# EAGLE schematic 24x16_RGB (EAGLE 6.4)

## Sheet 1 of 7
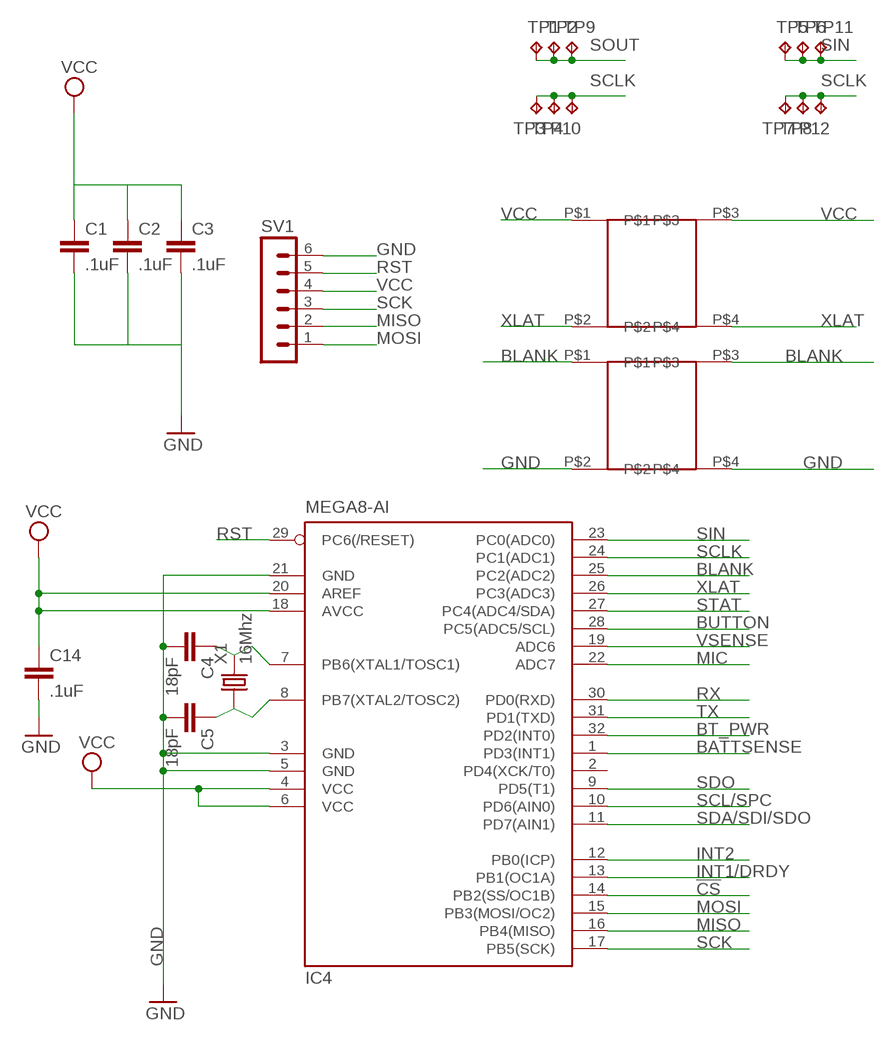
[diagram p0: schematic, sheet 1]

### Parts
C1  .1uF  CAP0805  [0805]
C2  .1uF  CAP0805  [0805]
C3  .1uF  CAP0805  [0805]
C4  18pF  CAP0805  [0805]
C5  18pF  CAP0805  [0805]
C14  .1uF  CAP0805  [0805]
IC4  MEGA8-AI  [TQFP32-08]
SLOT1  SLOT  [SLOT]
SLOT2  SLOT  [SLOT]
SV1  MA06-1  [MA06-1]
TP1  TPTP20SQ  [TP20SQ]
TP2  TPTP20SQ  [TP20SQ]
TP3  TPTP20SQ  [TP20SQ]
TP4  TPTP20SQ  [TP20SQ]
TP5  TPTP20SQ  [TP20SQ]
TP6  TPTP20SQ  [TP20SQ]
TP7  TPTP20SQ  [TP20SQ]
TP8  TPTP20SQ  [TP20SQ]
TP9  TPTP20SQ  [TP20SQ]
TP10  TPTP20SQ  [TP20SQ]
TP11  TPTP20SQ  [TP20SQ]
TP12  TPTP20SQ  [TP20SQ]
X1  16Mhz  CRYSTAL-5032  [5032]

### Nets
!CS: IC4.14(PB2(SS/OC1B)) ; also sheet 6
BATTSENSE: IC4.1(PD3(INT1)) ; also sheet 4
BLANK: IC4.25(PC2(ADC2)) SLOT2.P$1 SLOT2.P$3 ; also sheet 2
BT_PWR: IC4.32(PD2(INT0)) ; also sheet 5
BUTTON: IC4.28(PC5(ADC5/SCL)) ; also sheet 6
GND: C1.2 C2.2 C3.2 C4.2 C5.2 C14.2 IC4.3(GND) IC4.5(GND) IC4.21(GND) SLOT2.P$2 SLOT2.P$4 SV1.6 ; also sheet 2,4,5,6,7
INT1/DRDY: IC4.13(PB1(OC1A)) ; also sheet 6
INT2: IC4.12(PB0(ICP)) ; also sheet 6
MIC: IC4.22(ADC7) ; also sheet 7
MISO: IC4.16(PB4(MISO)) SV1.2
MOSI: IC4.15(PB3(MOSI/OC2)) SV1.1
N$7: C4.1 IC4.7(PB6(XTAL1/TOSC1)) X1.2
N$8: C5.1 IC4.8(PB7(XTAL2/TOSC2)) X1.1
RST: IC4.29(PC6(/RESET)) SV1.5 ; also sheet 6
RX: IC4.30(PD0(RXD)) ; also sheet 5
SCK: IC4.17(PB5(SCK)) SV1.3
SCL/SPC: IC4.10(PD6(AIN0)) ; also sheet 6
SCLK: IC4.24(PC1(ADC1)) TP3.TP TP4.TP TP7.TP TP8.TP TP10.TP TP12.TP ; also sheet 2
SDA/SDI/SDO: IC4.11(PD7(AIN1)) ; also sheet 6
SDO: IC4.9(PD5(T1)) ; also sheet 6
SIN: IC4.23(PC0(ADC0)) TP5.TP TP6.TP TP11.TP ; also sheet 2
SOUT: TP1.TP TP2.TP TP9.TP ; also sheet 2
STAT: IC4.27(PC4(ADC4/SDA)) ; also sheet 4
TX: IC4.31(PD1(TXD)) ; also sheet 5
VCC: C1.1 C2.1 C3.1 C14.1 IC4.4(VCC) IC4.6(VCC) IC4.18(AVCC) IC4.20(AREF) SLOT1.P$1 SLOT1.P$3 SV1.4 ; also sheet 2,3,4,5,6,7
VSENSE: IC4.19(ADC6)
XLAT: IC4.26(PC3(ADC3)) SLOT1.P$2 SLOT1.P$4 ; also sheet 2
Unconnected: IC4.2(PD4(XCK/T0))

## Sheet 2 of 7
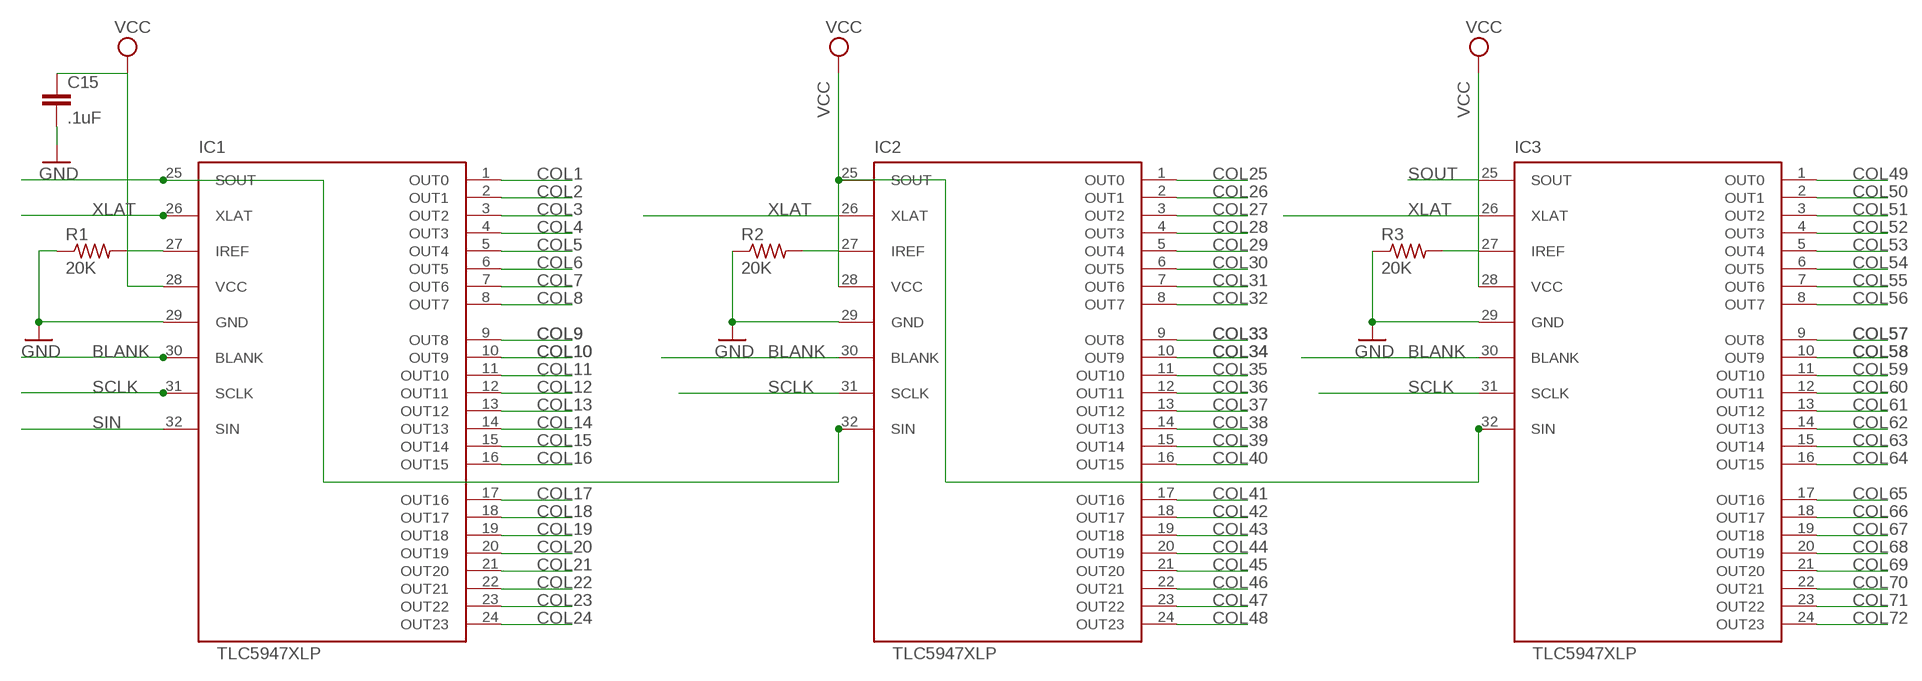
[diagram p1: schematic, sheet 2]

### Parts
C15  .1uF  CAP0805  [0805]
IC1  TLC5947XLP  [QFN32_XLP]
IC2  TLC5947XLP  [QFN32_XLP]
IC3  TLC5947XLP  [QFN32_XLP]
R1  20K  R-US_R0805  [R0805]
R2  20K  R-US_R0805  [R0805]
R3  20K  R-US_R0805  [R0805]

### Nets
BLANK: IC1.30(BLANK) IC2.30(BLANK) IC3.30(BLANK) ; also sheet 1
COL1: IC1.1(OUT0) ; also sheet 3
COL2: IC1.2(OUT1) ; also sheet 3
COL3: IC1.3(OUT2) ; also sheet 3
COL4: IC1.4(OUT3) ; also sheet 3
COL5: IC1.5(OUT4) ; also sheet 3
COL6: IC1.6(OUT5) ; also sheet 3
COL7: IC1.7(OUT6) ; also sheet 3
COL8: IC1.8(OUT7) ; also sheet 3
COL9: IC1.9(OUT8) ; also sheet 3
COL10: IC1.10(OUT9) ; also sheet 3
COL11: IC1.11(OUT10) ; also sheet 3
COL12: IC1.12(OUT11) ; also sheet 3
COL13: IC1.13(OUT12) ; also sheet 3
COL14: IC1.14(OUT13) ; also sheet 3
COL15: IC1.15(OUT14) ; also sheet 3
COL16: IC1.16(OUT15) ; also sheet 3
COL17: IC1.17(OUT16) ; also sheet 3
COL18: IC1.18(OUT17) ; also sheet 3
COL19: IC1.19(OUT18) ; also sheet 3
COL20: IC1.20(OUT19) ; also sheet 3
COL21: IC1.21(OUT20) ; also sheet 3
COL22: IC1.22(OUT21) ; also sheet 3
COL23: IC1.23(OUT22) ; also sheet 3
COL24: IC1.24(OUT23) ; also sheet 3
COL25: IC2.1(OUT0) ; also sheet 3
COL26: IC2.2(OUT1) ; also sheet 3
COL27: IC2.3(OUT2) ; also sheet 3
COL28: IC2.4(OUT3) ; also sheet 3
COL29: IC2.5(OUT4) ; also sheet 3
COL30: IC2.6(OUT5) ; also sheet 3
COL31: IC2.7(OUT6) ; also sheet 3
COL32: IC2.8(OUT7) ; also sheet 3
COL33: IC2.9(OUT8) ; also sheet 3
COL34: IC2.10(OUT9) ; also sheet 3
COL35: IC2.11(OUT10) ; also sheet 3
COL36: IC2.12(OUT11) ; also sheet 3
COL37: IC2.13(OUT12) ; also sheet 3
COL38: IC2.14(OUT13) ; also sheet 3
COL39: IC2.15(OUT14) ; also sheet 3
COL40: IC2.16(OUT15) ; also sheet 3
COL41: IC2.17(OUT16) ; also sheet 3
COL42: IC2.18(OUT17) ; also sheet 3
COL43: IC2.19(OUT18) ; also sheet 3
COL44: IC2.20(OUT19) ; also sheet 3
COL45: IC2.21(OUT20) ; also sheet 3
COL46: IC2.22(OUT21) ; also sheet 3
COL47: IC2.23(OUT22) ; also sheet 3
COL48: IC2.24(OUT23) ; also sheet 3
COL49: IC3.1(OUT0) ; also sheet 3
COL50: IC3.2(OUT1) ; also sheet 3
COL51: IC3.3(OUT2) ; also sheet 3
COL52: IC3.4(OUT3) ; also sheet 3
COL53: IC3.5(OUT4) ; also sheet 3
COL54: IC3.6(OUT5) ; also sheet 3
COL55: IC3.7(OUT6) ; also sheet 3
COL56: IC3.8(OUT7) ; also sheet 3
COL57: IC3.9(OUT8) ; also sheet 3
COL58: IC3.10(OUT9) ; also sheet 3
COL59: IC3.11(OUT10) ; also sheet 3
COL60: IC3.12(OUT11) ; also sheet 3
COL61: IC3.13(OUT12) ; also sheet 3
COL62: IC3.14(OUT13) ; also sheet 3
COL63: IC3.15(OUT14) ; also sheet 3
COL64: IC3.16(OUT15) ; also sheet 3
COL65: IC3.17(OUT16) ; also sheet 3
COL66: IC3.18(OUT17) ; also sheet 3
COL67: IC3.19(OUT18) ; also sheet 3
COL68: IC3.20(OUT19) ; also sheet 3
COL69: IC3.21(OUT20) ; also sheet 3
COL70: IC3.22(OUT21) ; also sheet 3
COL71: IC3.23(OUT22) ; also sheet 3
COL72: IC3.24(OUT23) ; also sheet 3
GND: C15.2 IC1.29(GND) IC2.29(GND) IC3.29(GND) R1.1 R2.1 R3.1 ; also sheet 1,4,5,6,7
HOLE: IC1.27(IREF) R1.2
N$2: IC2.27(IREF) R2.2
N$3: IC1.25(SOUT) IC2.32(SIN)
N$9: IC3.27(IREF) R3.2
N$35: IC2.25(SOUT) IC3.32(SIN)
SCLK: IC1.31(SCLK) IC2.31(SCLK) IC3.31(SCLK) ; also sheet 1
SIN: IC1.32(SIN) ; also sheet 1
SOUT: IC3.25(SOUT) ; also sheet 1
VCC: C15.1 IC1.28(VCC) IC2.28(VCC) IC3.28(VCC) ; also sheet 1,3,4,5,6,7
XLAT: IC1.26(XLAT) IC2.26(XLAT) IC3.26(XLAT) ; also sheet 1

## Sheet 3 of 7
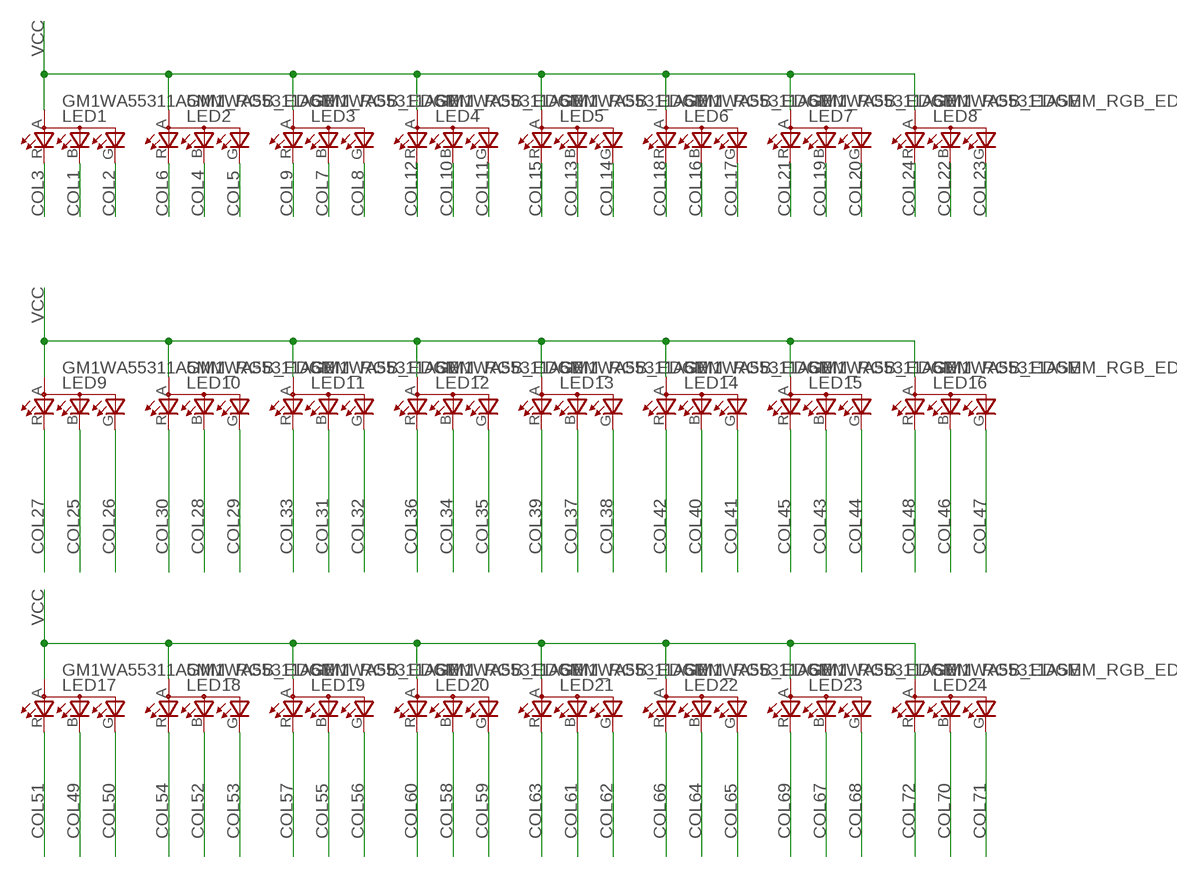
[diagram p2: schematic, sheet 3]

### Parts
LED1  GM1WA55311A5MM_RGB_EDGE  [LED5MM_RGB_EDGE]
LED2  GM1WA55311A5MM_RGB_EDGE  [LED5MM_RGB_EDGE]
LED3  GM1WA55311A5MM_RGB_EDGE  [LED5MM_RGB_EDGE]
LED4  GM1WA55311A5MM_RGB_EDGE  [LED5MM_RGB_EDGE]
LED5  GM1WA55311A5MM_RGB_EDGE  [LED5MM_RGB_EDGE]
LED6  GM1WA55311A5MM_RGB_EDGE  [LED5MM_RGB_EDGE]
LED7  GM1WA55311A5MM_RGB_EDGE  [LED5MM_RGB_EDGE]
LED8  GM1WA55311A5MM_RGB_EDGE  [LED5MM_RGB_EDGE]
LED9  GM1WA55311A5MM_RGB_EDGE  [LED5MM_RGB_EDGE]
LED10  GM1WA55311A5MM_RGB_EDGE  [LED5MM_RGB_EDGE]
LED11  GM1WA55311A5MM_RGB_EDGE  [LED5MM_RGB_EDGE]
LED12  GM1WA55311A5MM_RGB_EDGE  [LED5MM_RGB_EDGE]
LED13  GM1WA55311A5MM_RGB_EDGE  [LED5MM_RGB_EDGE]
LED14  GM1WA55311A5MM_RGB_EDGE  [LED5MM_RGB_EDGE]
LED15  GM1WA55311A5MM_RGB_EDGE  [LED5MM_RGB_EDGE]
LED16  GM1WA55311A5MM_RGB_EDGE  [LED5MM_RGB_EDGE]
LED17  GM1WA55311A5MM_RGB_EDGE  [LED5MM_RGB_EDGE]
LED18  GM1WA55311A5MM_RGB_EDGE  [LED5MM_RGB_EDGE]
LED19  GM1WA55311A5MM_RGB_EDGE  [LED5MM_RGB_EDGE]
LED20  GM1WA55311A5MM_RGB_EDGE  [LED5MM_RGB_EDGE]
LED21  GM1WA55311A5MM_RGB_EDGE  [LED5MM_RGB_EDGE]
LED22  GM1WA55311A5MM_RGB_EDGE  [LED5MM_RGB_EDGE]
LED23  GM1WA55311A5MM_RGB_EDGE  [LED5MM_RGB_EDGE]
LED24  GM1WA55311A5MM_RGB_EDGE  [LED5MM_RGB_EDGE]

### Nets
COL1: LED1.B(CBLUE) ; also sheet 2
COL2: LED1.G(CGREEN) ; also sheet 2
COL3: LED1.R(CRED) ; also sheet 2
COL4: LED2.B(CBLUE) ; also sheet 2
COL5: LED2.G(CGREEN) ; also sheet 2
COL6: LED2.R(CRED) ; also sheet 2
COL7: LED3.B(CBLUE) ; also sheet 2
COL8: LED3.G(CGREEN) ; also sheet 2
COL9: LED3.R(CRED) ; also sheet 2
COL10: LED4.B(CBLUE) ; also sheet 2
COL11: LED4.G(CGREEN) ; also sheet 2
COL12: LED4.R(CRED) ; also sheet 2
COL13: LED5.B(CBLUE) ; also sheet 2
COL14: LED5.G(CGREEN) ; also sheet 2
COL15: LED5.R(CRED) ; also sheet 2
COL16: LED6.B(CBLUE) ; also sheet 2
COL17: LED6.G(CGREEN) ; also sheet 2
COL18: LED6.R(CRED) ; also sheet 2
COL19: LED7.B(CBLUE) ; also sheet 2
COL20: LED7.G(CGREEN) ; also sheet 2
COL21: LED7.R(CRED) ; also sheet 2
COL22: LED8.B(CBLUE) ; also sheet 2
COL23: LED8.G(CGREEN) ; also sheet 2
COL24: LED8.R(CRED) ; also sheet 2
COL25: LED9.B(CBLUE) ; also sheet 2
COL26: LED9.G(CGREEN) ; also sheet 2
COL27: LED9.R(CRED) ; also sheet 2
COL28: LED10.B(CBLUE) ; also sheet 2
COL29: LED10.G(CGREEN) ; also sheet 2
COL30: LED10.R(CRED) ; also sheet 2
COL31: LED11.B(CBLUE) ; also sheet 2
COL32: LED11.G(CGREEN) ; also sheet 2
COL33: LED11.R(CRED) ; also sheet 2
COL34: LED12.B(CBLUE) ; also sheet 2
COL35: LED12.G(CGREEN) ; also sheet 2
COL36: LED12.R(CRED) ; also sheet 2
COL37: LED13.B(CBLUE) ; also sheet 2
COL38: LED13.G(CGREEN) ; also sheet 2
COL39: LED13.R(CRED) ; also sheet 2
COL40: LED14.B(CBLUE) ; also sheet 2
COL41: LED14.G(CGREEN) ; also sheet 2
COL42: LED14.R(CRED) ; also sheet 2
COL43: LED15.B(CBLUE) ; also sheet 2
COL44: LED15.G(CGREEN) ; also sheet 2
COL45: LED15.R(CRED) ; also sheet 2
COL46: LED16.B(CBLUE) ; also sheet 2
COL47: LED16.G(CGREEN) ; also sheet 2
COL48: LED16.R(CRED) ; also sheet 2
COL49: LED17.B(CBLUE) ; also sheet 2
COL50: LED17.G(CGREEN) ; also sheet 2
COL51: LED17.R(CRED) ; also sheet 2
COL52: LED18.B(CBLUE) ; also sheet 2
COL53: LED18.G(CGREEN) ; also sheet 2
COL54: LED18.R(CRED) ; also sheet 2
COL55: LED19.B(CBLUE) ; also sheet 2
COL56: LED19.G(CGREEN) ; also sheet 2
COL57: LED19.R(CRED) ; also sheet 2
COL58: LED20.B(CBLUE) ; also sheet 2
COL59: LED20.G(CGREEN) ; also sheet 2
COL60: LED20.R(CRED) ; also sheet 2
COL61: LED21.B(CBLUE) ; also sheet 2
COL62: LED21.G(CGREEN) ; also sheet 2
COL63: LED21.R(CRED) ; also sheet 2
COL64: LED22.B(CBLUE) ; also sheet 2
COL65: LED22.G(CGREEN) ; also sheet 2
COL66: LED22.R(CRED) ; also sheet 2
COL67: LED23.B(CBLUE) ; also sheet 2
COL68: LED23.G(CGREEN) ; also sheet 2
COL69: LED23.R(CRED) ; also sheet 2
COL70: LED24.B(CBLUE) ; also sheet 2
COL71: LED24.G(CGREEN) ; also sheet 2
COL72: LED24.R(CRED) ; also sheet 2
VCC: LED1.A LED2.A LED3.A LED4.A LED5.A LED6.A LED7.A LED8.A LED9.A LED10.A LED11.A LED12.A LED13.A LED14.A LED15.A LED16.A LED17.A LED18.A LED19.A LED20.A LED21.A LED22.A LED23.A LED24.A ; also sheet 1,2,4,5,6,7

## Sheet 4 of 7
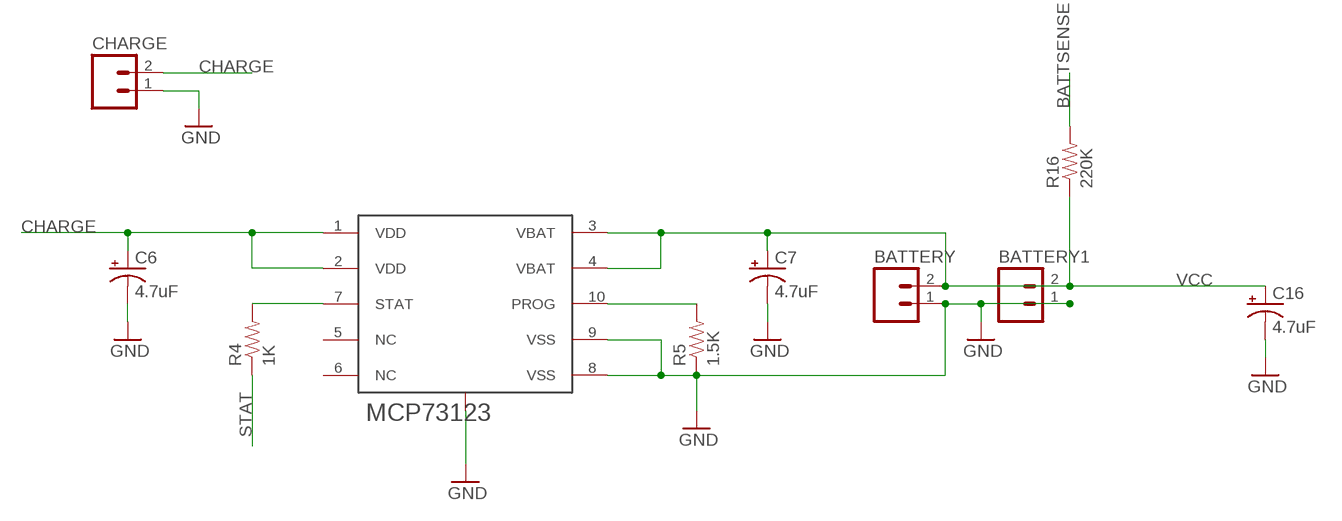
[diagram p3: schematic, sheet 4]

### Parts
BATTERY  M02PTH  [1X02]
BATTERY1  M02PTH  [1X02]
C6  4.7uF  CAP_POL3528  [EIA3528]
C7  4.7uF  CAP_POL3528  [EIA3528]
C16  4.7uF  CAP_POL3528  [EIA3528]
CHARGE  M02PTH  [1X02]
IC5  MCP73123  [DFN10_3X3]
R4  1K  RESISTOR0805  [0805]
R5  1.5K  RESISTOR0805  [0805]
R16  220K  RESISTOR0805  [0805]

### Nets
BATTSENSE: R16.2 ; also sheet 1
CHARGE: C6.A(+) CHARGE.2 IC5.1(VDD) IC5.2(VDD)
GND: BATTERY1.1 BATTERY.1 C6.C(-) C7.C(-) C16.C(-) CHARGE.1 IC5.8(VSS) IC5.9(VSS) IC5.EXP(GND) R5.1 ; also sheet 1,2,5,6,7
N$1: IC5.7(STAT) R4.2
N$6: IC5.10(PROG) R5.2
STAT: R4.1 ; also sheet 1
VCC: BATTERY1.2 BATTERY.2 C7.A(+) C16.A(+) IC5.3(VBAT) IC5.4(VBAT) R16.1 ; also sheet 1,2,3,5,6,7
Unconnected: IC5.5(NC) IC5.6(NC)

## Sheet 5 of 7
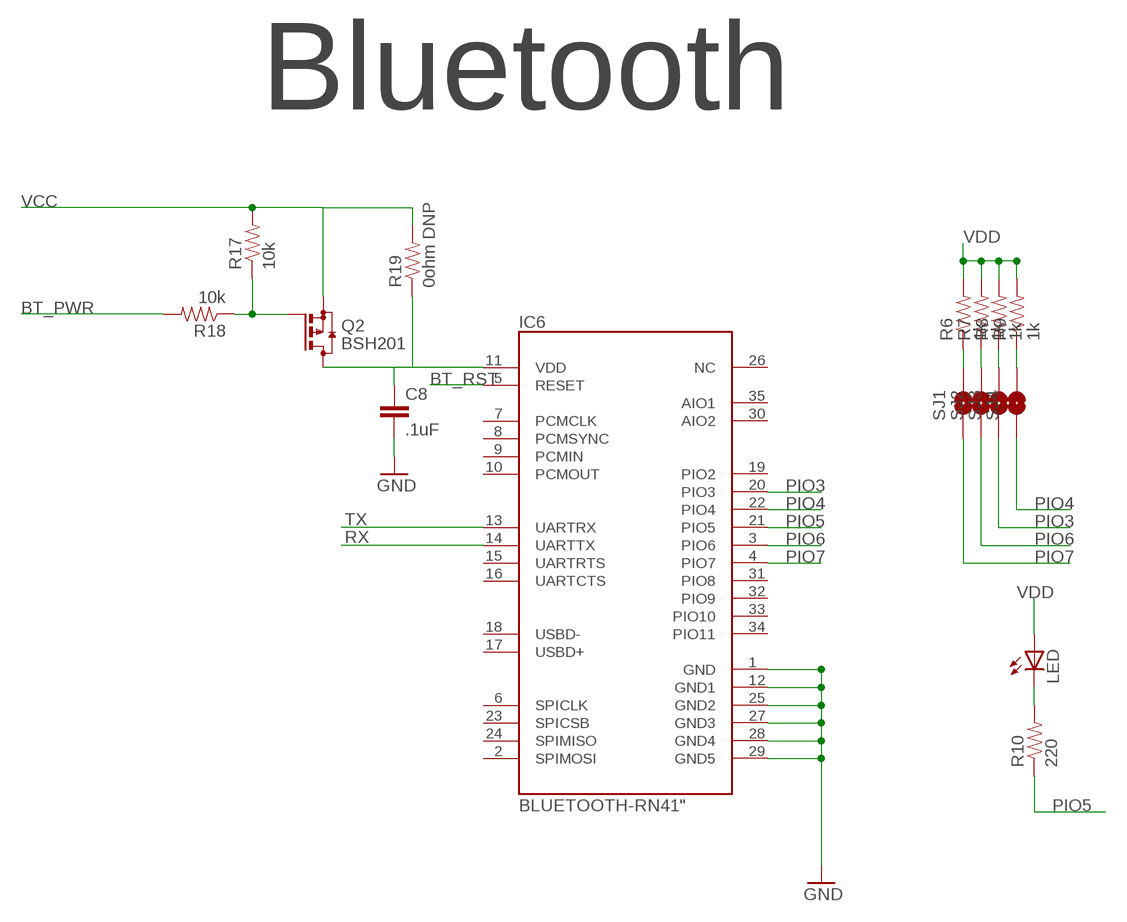
[diagram p4: schematic, sheet 5]

### Parts
C8  .1uF  CAP0805  [0805]
IC6  BLUETOOTH-RN41"  [RN41]
LED  LEDCHIP-LED0603  [CHIP-LED0603]
Q2  BSH201  BSS84  [SOT23]
R6  1k  RESISTOR  [0805]
R7  1k  RESISTOR  [0805]
R8  1k  RESISTOR  [0805]
R9  1k  RESISTOR  [0805]
R10  220  RESISTOR  [0805]
R17  10k  RESISTOR  [0805]
R18  10k  RESISTOR  [0805]
R19  0ohm DNP  RESISTOR  [0805]
SJ1  SOLDERJUMPERNO  [SJ_2S-NO]
SJ2  SOLDERJUMPERNO  [SJ_2S-NO]
SJ3  SOLDERJUMPERNO  [SJ_2S-NO]
SJ4  SOLDERJUMPERNO  [SJ_2S-NO]

### Nets
BT_PWR: R18.2 ; also sheet 1
BT_RST: IC6.5(RESET) ; also sheet 6
GND: C8.2 IC6.1(GND) IC6.12(GND1) IC6.25(GND2) IC6.27(GND3) IC6.28(GND4) IC6.29(GND5) ; also sheet 1,2,4,6,7
N$4: LED.C R10.2
N$5: R6.1 SJ1.2
N$18: Q2.1(G) R17.1 R18.1
N$21: R8.1 SJ3.2
N$23: R7.1 SJ2.2
N$24: R9.1 SJ4.2
PIO3: IC6.20(PIO3) SJ3.1
PIO4: IC6.22(PIO4) SJ4.1
PIO5: IC6.21(PIO5) R10.1
PIO6: IC6.3(PIO6) SJ2.1
PIO7: IC6.4(PIO7) SJ1.1
RX: IC6.14(UARTTX) ; also sheet 1
TX: IC6.13(UARTRX) ; also sheet 1
VCC: Q2.2(S) R17.2 R19.2 ; also sheet 1,2,3,4,6,7
VDD: C8.1 IC6.11(VDD) LED.A Q2.3(D) R6.2 R7.2 R8.2 R9.2 R19.1
Unconnected: IC6.2(SPIMOSI) IC6.6(SPICLK) IC6.7(PCMCLK) IC6.8(PCMSYNC) IC6.9(PCMIN) IC6.10(PCMOUT) IC6.15(UARTRTS) IC6.16(UARTCTS) IC6.17(USBD+) IC6.18(USBD-) IC6.19(PIO2) IC6.23(SPICSB) IC6.24(SPIMISO) IC6.26(NC) IC6.30(AIO2) IC6.31(PIO8) IC6.32(PIO9) IC6.33(PIO10) IC6.34(PIO11) IC6.35(AIO1)

### Notes on the sheet
- Bluetooth

## Sheet 6 of 7
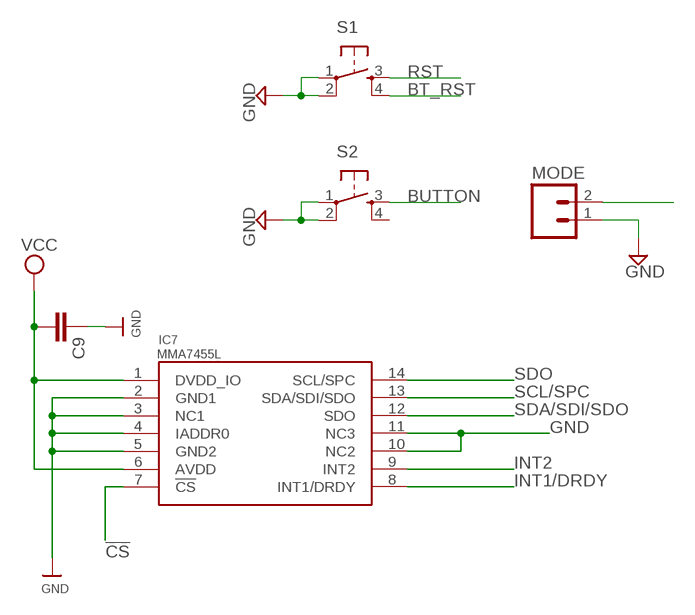
[diagram p5: schematic, sheet 6]

### Parts
C9  CAP0805  [0805]
IC7  MMA7455L  [LGA-14]
MODE  M02PTH  [1X02]
S1  TAC_SWITCHSMD  [TACTILE_SWITCH_SMD]
S2  TAC_SWITCHSMD  [TACTILE_SWITCH_SMD]

### Nets
!CS: IC7.7(!CS) ; also sheet 1
BT_RST: S1.4 ; also sheet 5
BUTTON: MODE.2 S2.3 ; also sheet 1
GND: C9.1 IC7.2(GND1) IC7.3(NC1) IC7.4(IADDR0) IC7.5(GND2) IC7.10(NC2) IC7.11(NC3) MODE.1 S1.1 S1.2 S2.1 S2.2 ; also sheet 1,2,4,5,7
INT1/DRDY: IC7.8(INT1/DRDY) ; also sheet 1
INT2: IC7.9(INT2) ; also sheet 1
RST: S1.3 ; also sheet 1
SCL/SPC: IC7.13(SDA/SDI/SDO) ; also sheet 1
SDA/SDI/SDO: IC7.12(SDO) ; also sheet 1
SDO: IC7.14(SCL/SPC) ; also sheet 1
VCC: C9.2 IC7.1(DVDD_IO) IC7.6(AVDD) ; also sheet 1,2,3,4,5,7
Unconnected: S2.4

## Sheet 7 of 7
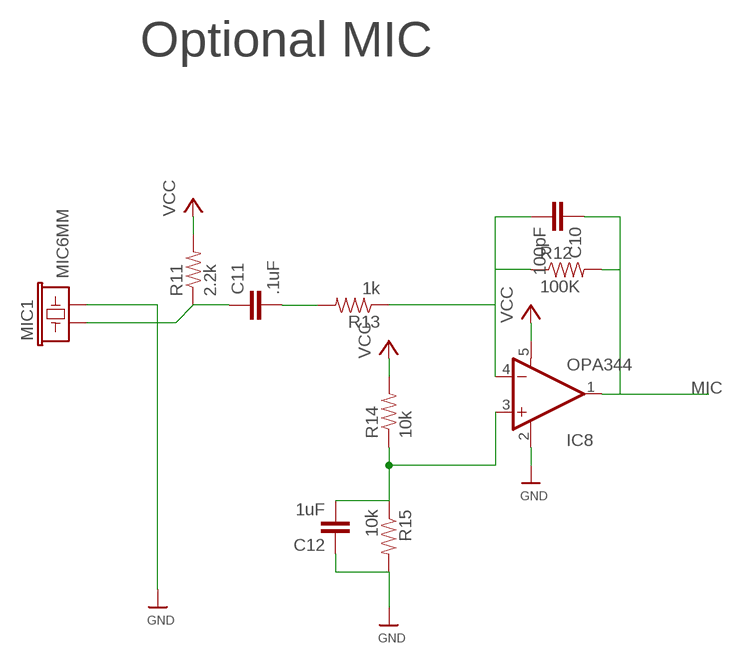
[diagram p6: schematic, sheet 7]

### Parts
C10  100pF  CAP0805  [0805]
C11  .1uF  CAP0805  [0805]
C12  1uF  CAP0805  [0805]
IC8  OPA344  [SOT23-5]
MIC1  MIC6MM  [MIC-6MM]
R11  2.2k  RESISTOR  [0805]
R12  100K  RESISTOR  [0805]
R13  1k  RESISTOR  [0805]
R14  10k  RESISTOR  [0805]
R15  10k  RESISTOR  [0805]

### Nets
GND: C12.1 IC8.2(V-) MIC1.2 R15.2 ; also sheet 1,2,4,5,6
MIC: C10.1 IC8.1(OUT) R12.2 ; also sheet 1
N$14: C11.2 R13.2
N$15: C11.1 MIC1.1 R11.1
N$16: C12.2 IC8.3(+IN) R14.1 R15.1
N$17: C10.2 IC8.4(-IN) R12.1 R13.1
VCC: IC8.5(V+) R11.2 R14.2 ; also sheet 1,2,3,4,5,6

### Notes on the sheet
- Optional MIC

## Library data of the parts
BATTERY BATTERY1 CHARGE = SparkFun:M02: Header 2 Standard 2-pin 0.1" header. Use with straight break away headers (SKU : PRT-00116), right angle break away headers (PRT-00553), swiss pins (PRT-00743), machine pins (PRT-00117), and female headers (PRT-00115). Molex polarized connector foot print use with SKU : PRT-08233 with associated crimp pins and housings.
C1-C5 C14 C15 = slice_noshift:CAP: Capacitor Standard 0603 ceramic capacitor, and 0.1" leaded capacitor.
C6 C7 C16 = slice_noshift:CAP_POL: Capacitor Polarized These are standard SMD and PTH capacitors. Normally 10uF, 47uF, and 100uF in electrolytic and tantalum varieties. Always verify the external diameter of the through hole cap, it varies with capacity, voltage, and manufacturer. The EIA devices should be standard.
C8-C12 = SparkFun:CAP: Capacitor Standard 0603 ceramic capacitor, and 0.1" leaded capacitor.
IC1-IC3 = slice_noshift:TLC5947
IC4 = atmel:MEGA8: MICROCONTROLLER 8 Kbytes FLASH, 1 kbytes SRAM, 512 bytes EEPROM, USART, 6-channel 10 bit ADC, 2-channel 8 bit ADC Pin compatible with Atmega48, ATMega88, ATMega168 Source: avr.lbr; MPN: ATMEGA8-16AU; OC_FARNELL: 9171371; OC_NEWARK: 73M8863
IC5 = 24x16_RGB:MCP73123
IC6 = NSL_Mini_Quad:BLUETOOTH-RN41
IC7 = MMA7455Lbreakoutboard-v1a:MMA7455L
IC8 = SparkFun:OPA344
LED = led:LED: LED OSRAM: - CHIPLED LG R971, LG N971, LY N971, LG Q971, LY Q971, LO R971, LY R971 LH N974, LH R974 LS Q976, LO Q976, LY Q976 LO Q996 - Hyper CHIPLED LW Q18S LB Q993, LB Q99A, LB R99A - SideLED LS A670, LO A670, LY A670, LG A670, LP A670 LB A673, LV A673, LT A673, LW A673 LH A674 LY A675 LS A676, LA A676, LO A676, LY A676, LW A676 LS A679, LY A679, LG A679 - Hyper Micro SIDELED® LS Y876, LA Y876, LO Y876, LY Y876 LT Y87S - SmartLED LW L88C, LW L88S LB L89C, LB L89S, LG L890 LS L89K, LO L89K, LY L89K LS L896, LA L896, LO L896, LY L896 - TOPLED LS T670, LO T670, LY T670, LG T670, LP T670 LSG T670, LSP T670, LSY T670, LOP T670, LYG T670 LG T671, LOG T671, LSG T671 LB T673, LV T673, LT T673, LW T673 LH T674 LS T676, LA T676, LO T676, LY T676, LB T676, LH T676, LSB T676, LW T676 LB T67C, LV T67C, LT T67C, LS T67K, LO T67K, LY T67K, LW E67C LS E67B, LA E67B, LO E67B, LY E67B, LB E67C, LV E67C, LT E67C LW T67C LS T679, LY T679, LG T679 LS T770, LO T770, LY T770, LG T770, LP T770 LB T773, LV T773, LT T773, LW T773 LH T774 LS E675, LA E675, LY E675, LS T675 LS T776, LA T776, LO T776, LY T776, LB T776 LHGB T686 LT T68C, LB T68C - Hyper Mini TOPLED® LB M676 - Mini TOPLED Santana® LG M470 LS M47K, LO M47K, LY M47K Source: http://www.osram.convergy.de LUXEON: - LUMILED® LXK2-PW12-R00, LXK2-PW12-S00, LXK2-PW14-U00, LXK2-PW14-V00 LXK2-PM12-R00, LXK2-PM12-S00, LXK2-PM14-U00 LXK2-PE12-Q00, LXK2-PE12-R00, LXK2-PE12-S00, LXK2-PE14-T00, LXK2-PE14-U00 LXK2-PB12-K00, LXK2-PB12-L00, LXK2-PB12-M00, LXK2-PB14-N00, LXK2-PB14-P00, LXK2-PB14-Q00 LXK2-PR12-L00, LXK2-PR12-M00, LXK2-PR14-Q00, LXK2-PR14-R00 LXK2-PD12-Q00, LXK2-PD12-R00, LXK2-PD12-S00 LXK2-PH12-R00, LXK2-PH12-S00 LXK2-PL12-P00, LXK2-PL12-Q00, LXK2-PL12-R00 Source: www.luxeon.com KINGBRIGHT: KA-3528ASYC Source: www.kingbright.com
LED1-LED24 = 24x16_RGB:GM1WA55311A: Chip LED RGB Source: http://document.sharpsma.com/files/GM1WA55311A_SS.pdf
MIC1 = slice_noshift:MIC: Microphone Omni-directional electret microphone. 9.7mm standard diameter.
MODE = 24x16_RGB:M02: Header 2 Standard 2-pin 0.1" header. Use with straight break away headers (SKU : PRT-00116), right angle break away headers (PRT-00553), swiss pins (PRT-00743), machine pins (PRT-00117), and female headers (PRT-00115). Molex polarized connector foot print use with SKU : PRT-08233 with associated crimp pins and housings.
Q2 = transistor-small-signal:BSS84: P-CHANNEL MOS FET
R1-R3 = rcl:R-US_: RESISTOR, American symbol
R4 R5 R16 = slice_noshift:RESISTOR: Resistor Basic schematic elements and footprints for 0603, 1206, and PTH 1/10th watt (small) resistors.
R6-R15 R17-R19 = SparkFun:RESISTOR: Resistor Basic schematic elements and footprints for 0603, 1206, and PTH 1/10th watt (small) resistors.
S1 S2 = SparkFun:TAC_SWITCH: Momentary Switch Button commonly used for reset or general input. Spark Fun Electronics SKU : COM-00097
SJ1-SJ4 = SparkFun:SOLDERJUMPER: Solder Jumper Standard SMD solder jumper. Used to automate production. Two varients : Normally Open and Normally Closed are the same, but have different paste layers. NC will have a large amount of paste and should jumper during reflow.
SLOT1 SLOT2 = slice:SLOT
SV1 = NSL:MA06-1: PIN HEADER
TP1-TP12 = testpad:TP: Test pad
X1 = NSL_MiniQuad:CRYSTAL*: CRYSTAL